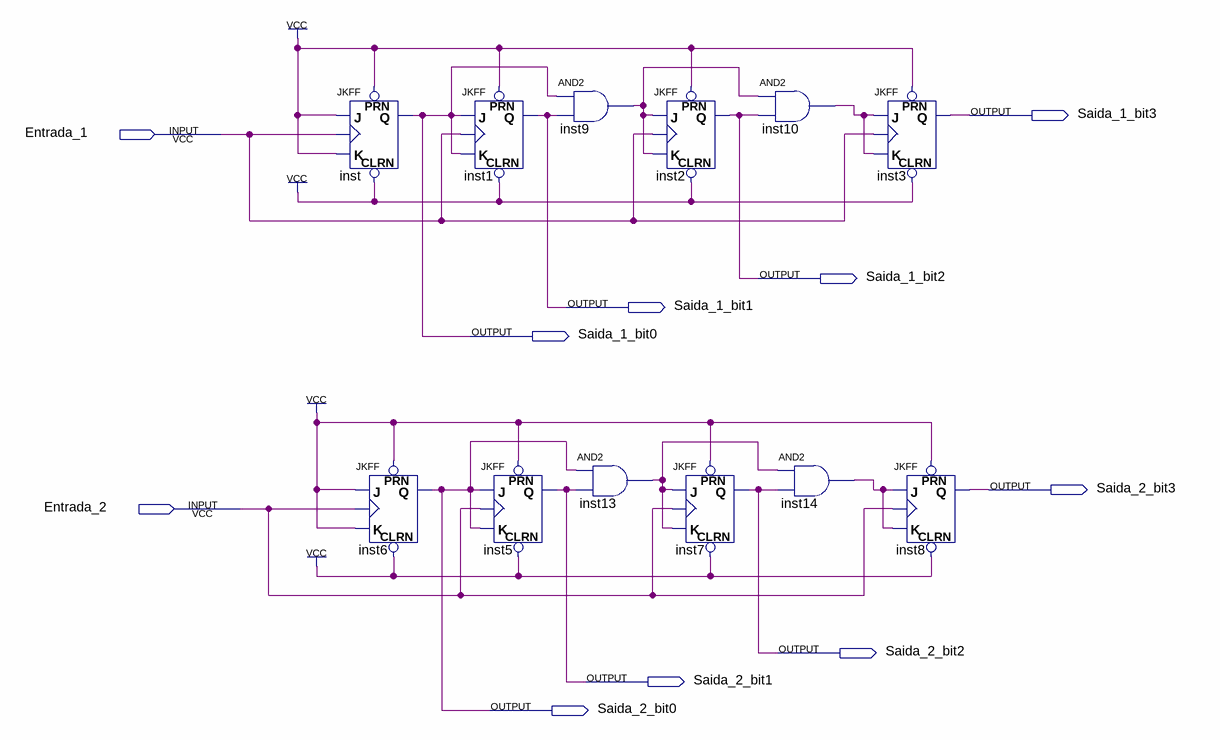
[diagram p0: schematic sheet]
// Quartus schematic contador.bdf as structural Verilog: 12 symbols, 10 pins
module contador (
  input  Entrada_1,
  input  Entrada_2,
  output Saida_1_bit3,
  output Saida_1_bit2,
  output Saida_1_bit1,
  output Saida_1_bit0,
  output Saida_2_bit3,
  output Saida_2_bit2,
  output Saida_2_bit1,
  output Saida_2_bit0
);

  wire inst9_out, inst10_out, inst13_out, inst14_out;

  JKFF inst (.PRN(1'b1), .CLRN(1'b1), .K(1'b1), .J(1'b1), .CLK(Entrada_1), .Q(Saida_1_bit0));
  JKFF inst6 (.PRN(1'b1), .CLRN(1'b1), .K(1'b1), .J(1'b1), .CLK(Entrada_2), .Q(Saida_2_bit0));
  JKFF inst1 (.PRN(1'b1), .CLRN(1'b1), .K(Saida_1_bit0), .J(Saida_1_bit0), .CLK(Entrada_1), .Q(Saida_1_bit1));
  JKFF inst5 (.PRN(1'b1), .CLRN(1'b1), .K(Saida_2_bit0), .J(Saida_2_bit0), .CLK(Entrada_2), .Q(Saida_2_bit1));
  and inst9 (inst9_out, Saida_1_bit0, Saida_1_bit1);
  and inst13 (inst13_out, Saida_2_bit0, Saida_2_bit1);
  JKFF inst2 (.PRN(1'b1), .CLRN(1'b1), .K(inst9_out), .J(inst9_out), .CLK(Entrada_1), .Q(Saida_1_bit2));
  JKFF inst7 (.PRN(1'b1), .CLRN(1'b1), .K(inst13_out), .J(inst13_out), .CLK(Entrada_2), .Q(Saida_2_bit2));
  and inst10 (inst10_out, inst9_out, Saida_1_bit2);
  and inst14 (inst14_out, inst13_out, Saida_2_bit2);
  JKFF inst3 (.PRN(1'b1), .CLRN(1'b1), .K(inst10_out), .J(inst10_out), .CLK(Entrada_1), .Q(Saida_1_bit3));
  JKFF inst8 (.PRN(1'b1), .CLRN(1'b1), .K(inst14_out), .J(inst14_out), .CLK(Entrada_2), .Q(Saida_2_bit3));
endmodule
